# EasyEDA Pro project HNDX.eprj, schematic Schematic1_3
Board Name: mspm0g3507; Create Date: 2024-08-21; Page Name: P1; Project Name: GP; Schematic Name: Schematic1_3; Update Date: 2025-07-14; Company: 嘉立创EDA; Page Size: A4; Version: V1.0
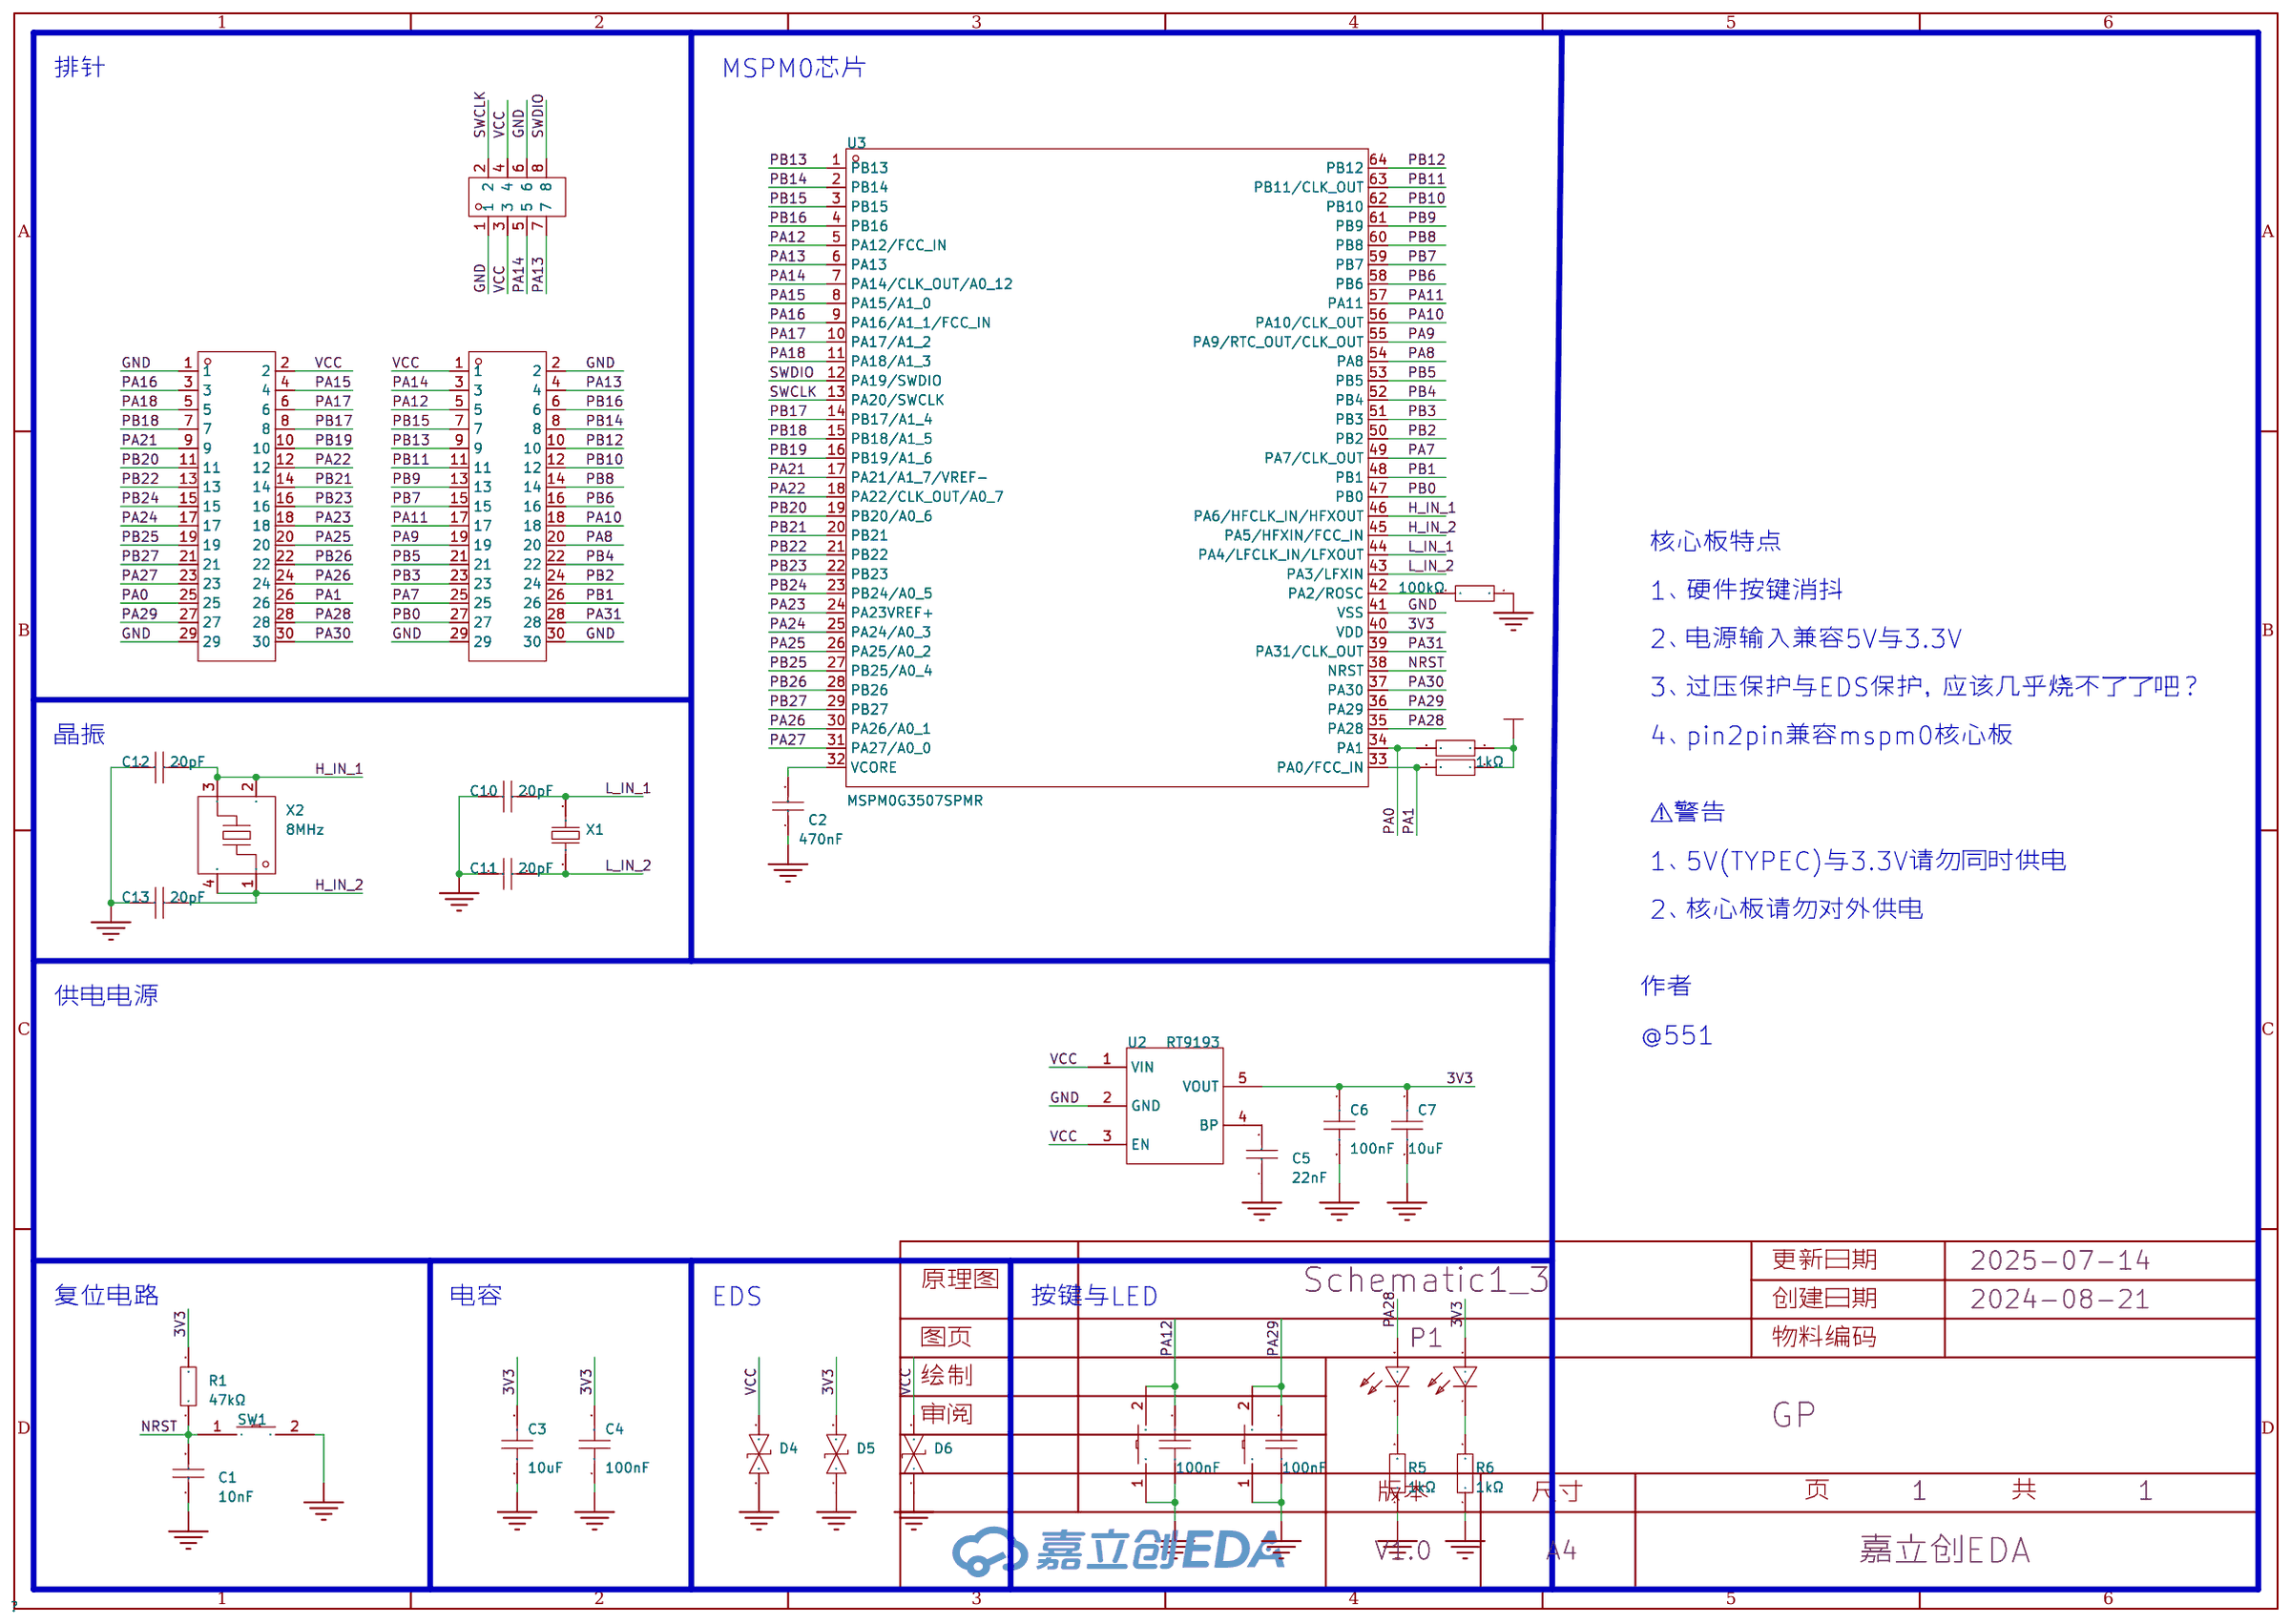
[diagram p0: schematic sheet]

## Parts
C1  10nF  [C0603]
C2  470nF  [C0603]
C3  10uF  [C0603]
C4  100nF  [C0603]
C5  22nF  [C0603]
C6  100nF  [C0603]
C7  10uF  [C0603]
C8  100nF  [C0603]
C9  100nF  [C0603]
C10  20pF  [C0603]
C11  20pF  [C0603]
C12  20pF  [C0603]
C13  20pF  [C0603]
D4  0603ESDA-05N  [D0603-BI]
D5  0603ESDA-05N  [D0603-BI]
D6  0603ESDA-05N  [D0603-BI]
H3  PZ254R-12-8P  [HDR-TH_8P-P2.54-H-M-R2-C4-S2.54]
LED1  NCD0603R1  [LED0603-RD_RED]
LED2  NCD0603R1  [LED0603-RD_RED]
R1  47kΩ  [R0603]
R2  1kΩ  [R0603]
R3  1kΩ  [R0603]
R4  100kΩ  [R0603]
R5  1kΩ  [R0603]
R6  1kΩ  [R0603]
SW1  TS-1101-C-W  [SW-SMD_L6.0-W3.3-LS8.0]
SW2  TS-1101-C-W  [SW-SMD_L6.0-W3.3-LS8.0]
SW3  TS-1101-C-W  [SW-SMD_L6.0-W3.3-LS8.0]
U2  RT9193  [SOT-23-5_L3.0-W1.7-P0.95-LS2.8-BL]
U3  MSPM0G3507SPMR  [LQFP-64_L10.0-W10.0-P0.50-LS12.0-BL]
U12  PZ254-2-15-Z-8.5  [HDR-TH_30P-P2.54-V-M-R2-C15-S2.54]
U13  PZ254-2-15-Z-8.5  [HDR-TH_30P-P2.54-V-M-R2-C15-S2.54]
X1  32.768kHz  [FC-135R_L3.2-W1.5]
X2  8MHz  [CRYSTAL-SMD_4P-L3.2-W2.5-BL-1]

## Library data of the parts
C1 = CC0603KRX7R9BB103: 容值:10nF;精度:±10%;额定电压:50V;材质(温度系数):X7R;; LCSC Part Name: 10nF ±10% 50V; Supplier Part: C100042; Manufacturer: YAGEO(国巨); Supplier Footprint: 0603; JLCPCB Part Class: 扩展库; Datasheet: https://atta.szlcsc.com/upload/public/pdf/source/20181008/C309510_22F155564471FAF6A489F7D68F34234E.pdf; Supplier: LCSC; Tolerance: ±10%; Voltage Rated: 50V; Temperature Coefficient: X7R
C2 = CL10B474KA8NNNC: 容值:470nF;精度:±10%;额定电压:25V;材质(温度系数):X7R;; LCSC Part Name: 470nF ±10% 25V; Supplier Part: C1623; Manufacturer: SAMSUNG(三星); Supplier Footprint: 0603; JLCPCB Part Class: 基础库; Datasheet: https://atta.szlcsc.com/upload/public/pdf/source/20160218/1457707763339.pdf; Supplier: LCSC; Tolerance: ±10%; Voltage Rated: 25V; Temperature Coefficient: X7R
C3 = CL10A106KP8NNNC: 容值:10uF;精度:±10%;额定电压:10V;材质(温度系数):X5R;; LCSC Part Name: 10uF ±10% 10V; Supplier Part: C19702; Manufacturer: SAMSUNG(三星); Supplier Footprint: 0603; JLCPCB Part Class: 基础库; Datasheet: https://atta.szlcsc.com/upload/public/pdf/source/20160218/1457707763339.pdf; Supplier: LCSC; Tolerance: ±10%; Voltage Rated: 10V; Temperature Coefficient: X5R
C4 C6 C8 C9 = CC0603KRX7R9BB104: 容值:100nF;精度:±10%;额定电压:50V;材质(温度系数):X7R;; LCSC Part Name: 100nF ±10% 50V; Supplier Part: C14663; Manufacturer: YAGEO(国巨); Supplier Footprint: 0603; JLCPCB Part Class: 基础库; Datasheet: https://atta.szlcsc.com/upload/public/pdf/source/20180910/C282072_33301C7F631E79921B82A8DAC6BCC5B3.pdf; Supplier: LCSC; Tolerance: ±10%; Voltage Rated: 50V; Temperature Coefficient: X7R
C5 = CL10B223KB8NNNC: 容值:22nF;精度:±10%;额定电压:50V;材质(温度系数):X7R;; LCSC Part Name: 22nF ±10% 50V; Supplier Part: C21122; Manufacturer: SAMSUNG(三星); Supplier Footprint: 0603; JLCPCB Part Class: 基础库; Datasheet: https://atta.szlcsc.com/upload/public/pdf/source/20160218/1457707763339.pdf; Supplier: LCSC; Tolerance: ±10%; Voltage Rated: 50V; Temperature Coefficient: X7R
C7 = GRM188R61E106KA73D: 容值:10uF;精度:±10%;额定电压:25V;材质(温度系数):X5R;; LCSC Part Name: 10uF ±10% 25V; Supplier Part: C344022; Manufacturer: muRata(村田); Supplier Footprint: 0603; JLCPCB Part Class: 扩展库; Datasheet: https://atta.szlcsc.com/upload/public/pdf/source/20181211/C344022_BB98D43E7DA95E5A749FBFE073C8A3E0.pdf; Supplier: LCSC; Tolerance: ±10%; Voltage Rated: 25V; Temperature Coefficient: X5R
C10-C13 = CC0603JRNPO9BN200: 容值:20pF;精度:±5%;额定电压:50V;材质(温度系数):NP0;; LCSC Part Name: 20pF ±5% 50V; Supplier Part: C105621; Manufacturer: YAGEO(国巨); Supplier Footprint: 0603; JLCPCB Part Class: 扩展库; Datasheet: https://atta.szlcsc.com/upload/public/pdf/source/20170505/1493957838062.pdf; Supplier: LCSC; Tolerance: ±5%; Voltage Rated: 50V; Temperature Coefficient: NP0
D4-D6 = 0603ESDA-05N: LCSC Part Name: 双向ESD; Supplier Part: C316054; Manufacturer: BORN(伯恩半导体); Supplier Footprint: 0603; JLCPCB Part Class: 扩展库; Datasheet: https://atta.szlcsc.com/upload/public/pdf/source/20200528/C316054_1CC523E9CE69E41C8DD5A05C832CCD1A.pdf; Supplier: LCSC; polarity: 双向; Reverse Stand-Off Voltage (Vrwm): 5V; Maximum Clamping Voltage: 50V; Type: ESD
H3 = PZ254R-12-8P: 插针结构:2x4P;间距:2.54mm;行距:2.54mm;圆针/方针:方针;安装类型:弯插;排数:双排;总PIN位数:8P;额定电流:-;额定电压:-;配合针长度:6mm;塑高:2.5mm;触头材质:黄铜;触头镀层:-;工作温度范围:-40℃~+105℃;颜色:黑色;; LCSC Part Name: 间距:2.54mm 2x4P 弯插 方针; Supplier Part: C492432; Manufacturer: XFCN(兴飞); Supplier Footprint: 弯插,P=2.54mm; JLCPCB Part Class: 扩展库; Datasheet: https://atta.szlcsc.com/upload/public/pdf/source/20200309/C492432_F55471C7391A7FE3415CB31C718B6320.pdf; Supplier: LCSC; Pin Structure: 2x4P; Pitch: 2.54mm; Row Spacing: 2.54mm; Circluar Pins/Square Pins: 方针; Mounting Type: 弯插; Number of Rows: 双排; Number of Pins: 8P; Length of Mating Pin: 6mm; Insulation Height: 2.5mm; Contact Material: 黄铜; Operating Temperature Range: -40℃~+105℃; Color: 黑色
LED1 LED2 = NCD0603R1_C84263: 灯头类型:-;发光颜色:红色;正向电压(VF):1.6V~2.6V;功率:65mW;正向电流:20mA;主波长:615nm~630nm;二极管配置:独立二极管;透镜颜色:无色透明透镜;色温:-;发光强度:80mcd~220mcd;发光角度:130°;载带方式:-;工作温度:-30℃~+85℃;; Supplier Part: C84263; Manufacturer: 国星光电; Supplier Footprint: 0603; JLCPCB Part Class: 扩展库; Datasheet: https://atta.szlcsc.com/upload/public/pdf/source/20200820/C84263_DABC6A75E58F576973B407FDBA283D60.pdf; Supplier: LCSC; Emitted Color: 红色; Forward Voltage (VF): 1.6V~2.6V; Power Dissipation: 65mW; Forward Current: 20mA; Dominant Wavelength: 615nm~630nm; Diode Configuration: 独立二极管; Lens Color: 无色透明透镜; Luminous Intensity: 80mcd~220mcd; Viewing Angle: 130°; Operating Temperature: -30℃~+85℃
R1 = 0603WAF4702T5E: 电阻类型:厚膜电阻;阻值:47kΩ;精度:±1%;功率:100mW;最大工作电压:75V;温度系数:±100ppm/℃;; LCSC Part Name: 47kΩ ±1% 100mW 厚膜电阻; Supplier Part: C25819; Manufacturer: UNI-ROYAL(厚声); Supplier Footprint: 0603; JLCPCB Part Class: 基础库; Datasheet: https://atta.szlcsc.com/upload/public/pdf/source/20200306/C422600_1E6D84923E4A46A82E41ADD87F860B5C.pdf; Supplier: LCSC; Type: 厚膜电阻; Tolerance: ±1%; Power(Watts): 100mW; Overload Voltage (Max): 75V; Temperature Coefficient: ±100ppm/℃; Operating Temperature Range: -55℃~+155℃
R2 R3 R5 R6 = 0603WAF1001T5E: 电阻类型:厚膜电阻;阻值:1kΩ;精度:±1%;功率:100mW;最大工作电压:75V;温度系数:±100ppm/℃;; LCSC Part Name: 1kΩ ±1% 100mW 厚膜电阻; Supplier Part: C21190; Manufacturer: UNI-ROYAL(厚声); Supplier Footprint: 0603; JLCPCB Part Class: 基础库; Datasheet: https://atta.szlcsc.com/upload/public/pdf/source/20200306/C422600_1E6D84923E4A46A82E41ADD87F860B5C.pdf; Supplier: LCSC; Type: 厚膜电阻; Tolerance: ±1%; Power(Watts): 100mW; Overload Voltage (Max): 75V; Temperature Coefficient: ±100ppm/℃; Operating Temperature Range: -55℃~+155℃
R4 = 0603WAF1003T5E: 电阻类型:厚膜电阻;阻值:100kΩ;精度:±1%;功率:100mW;最大工作电压:75V;温度系数:±100ppm/℃;; LCSC Part Name: 100kΩ ±1% 100mW 厚膜电阻; Supplier Part: C25803; Manufacturer: UNI-ROYAL(厚声); Supplier Footprint: 0603; JLCPCB Part Class: 基础库; Datasheet: https://atta.szlcsc.com/upload/public/pdf/source/20200306/C422600_1E6D84923E4A46A82E41ADD87F860B5C.pdf; Supplier: LCSC; Type: 厚膜电阻; Tolerance: ±1%; Power(Watts): 100mW; Overload Voltage (Max): 75V; Temperature Coefficient: ±100ppm/℃; Operating Temperature Range: -55℃~+155℃
SW1-SW3 = TS-1101-C-W: 电路结构:单刀单掷;按钮形状:矩形按钮;作用力:260gf;安装方式:立贴;开关长度:6mm;开关宽度:3.6mm;开关高度:2.5mm;带支架:不带;触点电流:50mA;额定电压(AC):-;额定电压(DC):12V;额定功率:-;绝缘电阻:-;带灯:无;机械寿命:5万次;; LCSC Part Name: 6*3.6*2.5mm 立贴 轻触开关; Supplier Part: C318938; Manufacturer: XKB Connectivity(中国星坤); Supplier Footprint: SMD; JLCPCB Part Class: 扩展库; Datasheet: https://atta.szlcsc.com/upload/public/pdf/source/20200227/C318938_C2E53B1EEDE37D980A33616AC086DE53.pdf; Supplier: LCSC; Circuit: 单刀单掷; Actuator Style: 矩形按钮; Operating Force: 260gf; Mounting Style: 立贴; Switch Length: 6mm; Switch Width: 3.6mm; Switch Height: 2.5mm; Strike Gundam: 不带; Contact Current: 50mA; Voltage Rating (DC): 12V; Actuator/Cap Color: 白色带淡绿; With Lamp: 无; Mechanical Life: 5万次; Operating Temperature: -30℃~+85℃
U2 = RT9193-33GB: 输出类型:固定;最大输入电压:5.5V;输出电压:3.3V;最大输出电流:300mA;电源纹波抑制比(PSRR):70dB;输出极性:正极;; LCSC Part Name: 输入5.5V 输出3.3V 300mA; Supplier Part: C15651; Manufacturer: RICHTEK(立锜); Supplier Footprint: SOT-23-5; JLCPCB Part Class: 扩展库; Datasheet: https://atta.szlcsc.com/upload/public/pdf/source/20130730/1457706628575.pdf; Supplier: LCSC; Output Type: 固定; Maximum Input Voltage: 5.5V; Output Voltage: 3.3V; MAX Output Current: 300mA; Power Supply Rejection Ratio (PSRR): 70dB; Dropout Voltage: 300mV@(300mA); standby current: 130uA; Operating Temperature: -40℃~+125℃; Output Polarity: 正极; Number of Outputs: 1
U3 = MSPM0G3507SPMR: Supplier Part: C9900086340; Supplier Footprint: SMD; JLCPCB Part Class: Extended Part; Supplier: LCSC
U12 U13 = PZ254-2-15-Z-8.5: 插针结构:2x15P;间距:2.54mm;圆针/方针:方针;安装类型:直插;排数:双排;总PIN位数:30P;额定电流:3A;额定电压:-;配合针长度:6mm;塑高:2.5mm;端接针长度:3mm;触头材质:黄铜;工作温度范围:-40℃~+105℃;焊接温度(最大值):260℃@10S;颜色:黑色;; LCSC Part Name: 2x15P 间距:2.54mm 方针 直插; Supplier Part: C3012255; Manufacturer: HCTL(华灿天禄); Supplier Footprint: 插件,P=2.54mm; JLCPCB Part Class: 扩展库; Datasheet: https://atta.szlcsc.com/upload/public/pdf/source/20230609/5BA09C8BEB9B31376F8BF6032FF67CAC.pdf; Supplier: LCSC; Pin Structure: 2x15P; Pitch: 2.54mm; Circluar Pins/Square Pins: 方针; Mounting Type: 直插; Number of Rows: 双排; Number of Pins: 30P; Current Rating (Max): 3A; Length of Mating Pin: 6mm; Insulation Height: 2.5mm; Length of End Connection Pin: 3mm; Contact Material: 黄铜; Operating Temperature Range: -40℃~+105℃; Soldering Temperature(Max): 260℃@10S; Color: 黑色
X1 = Q13FC13500004_C32346: 晶振类型:贴片晶振;频率:32.768kHz;常温频差:±20ppm;外接负载电容:12.5pF;; LCSC Part Name: 32.768kHz ±20ppm 12.5pF; Supplier Part: C32346; Manufacturer: EPSON(爱普生); Manufacturer Part: Q13FC13500004; Supplier Footprint: SMD3215-2P; JLCPCB Part Class: 基础库; Datasheet: https://atta.szlcsc.com/upload/public/pdf/source/20240418/0E0FF5F0356BA3753F616001439D1416.pdf; Supplier: LCSC; Crystal Type: 贴片晶振; Normal temperature Frequency Tolerance: ±20ppm; External load capacitor: 12.5pF; Equivalent Series Resistance (ESR): 70kΩ; Operating Temperature: -40℃~+85℃
X2 = XL2EL89COI-111YLC-8M: 晶振类型:贴片晶振;频率:8MHz;常温频差:±10ppm;外接负载电容:12pF;频率稳定度(全温):±20ppm;; LCSC Part Name: 8MHz ±10ppm 12pF; Supplier Part: C2973805; Manufacturer: YXC(扬兴晶振); Supplier Footprint: SMD3225-4P; JLCPCB Part Class: 扩展库; Datasheet: https://atta.szlcsc.com/upload/public/pdf/source/20240329/19D5F850207469550BEB00D7DFEDBC7A.pdf; Supplier: LCSC; Crystal Type: 贴片晶振; Normal temperature Frequency Tolerance: ±10ppm; External load capacitor: 12pF; Frequency Stability(Full temperature range): ±20ppm; Equivalent Series Resistance (ESR): 150Ω; Operating Temperature: -40℃~+85℃

## Nets
3V3: C3.2 C4.2 C6.1 C7.1 D5.2 LED2.2(A) R1.2 R2.2 R3.1 U2.5(VOUT) U3.40(VDD)
GND: C1.1 C2.1 C3.1 C4.1 C5.1 C6.2 C7.2 C8.2 C9.1 C10.1 C11.1 C12.1 C13.1 D4.1 D5.1 D6.1 H3.1 H3.6 R4.1 R5.1 R6.1 SW1.2 SW2.1 SW3.1 U2.2(GND) U3.41(VSS) U12.2 U12.29 U12.30 U13.1 U13.29
VCC: D4.2 D6.2 H3.3 H3.4 U2.1(VIN) U2.3(EN) U12.1 U13.2
H_IN_1: C12.2 U3.46(PA6/HFCLK_IN/HFXOUT) X2.2(GND) X2.3
H_IN_2: C13.2 U3.45(PA5/HFXIN/FCC_IN) X2.1 X2.4(GND)
L_IN_1: C10.2 U3.44(PA4/LFCLK_IN/LFXOUT) X1.2
L_IN_2: C11.2 U3.43(PA3/LFXIN) X1.1
NRST: C1.2 R1.1 SW1.1 U3.38(NRST)
PA0: R2.1 U3.34(PA1) U13.25
PA1: R3.2 U3.33(PA0/FCC_IN) U13.26
PA7: U3.49(PA7/CLK_OUT) U12.25
PA8: U3.54(PA8) U12.20
PA9: U3.55(PA9/RTC_OUT/CLK_OUT) U12.19
PA10: U3.56(PA10/CLK_OUT) U12.18
PA11: U3.57(PA11) U12.17
PA12: C8.1 SW2.2 U3.5(PA12/FCC_IN) U12.5
PA13: H3.7 U3.6(PA13) U12.4
PA14: H3.5 U3.7(PA14/CLK_OUT/A0_12) U12.3
PA15: U3.8(PA15/A1_0) U13.4
PA16: U3.9(PA16/A1_1/FCC_IN) U13.3
PA17: U3.10(PA17/A1_2) U13.6
PA18: U3.11(PA18/A1_3) U13.5
PA21: U3.17(PA21/A1_7/VREF-) U13.9
PA22: U3.18(PA22/CLK_OUT/A0_7) U13.12
PA23: U3.24(PA23VREF+) U13.18
PA24: U3.25(PA24/A0_3) U13.17
PA25: U3.26(PA25/A0_2) U13.20
PA26: U3.30(PA26/A0_1) U13.24
PA27: U3.31(PA27/A0_0) U13.23
PA28: LED1.2(A) U3.35(PA28) U13.28
PA29: C9.2 SW3.2 U3.36(PA29) U13.27
PA30: U3.37(PA30) U13.30
PA31: U3.39(PA31/CLK_OUT) U12.28
PB0: U3.47(PB0) U12.27
PB1: U3.48(PB1) U12.26
PB2: U3.50(PB2) U12.24
PB3: U3.51(PB3) U12.23
PB4: U3.52(PB4) U12.22
PB5: U3.53(PB5) U12.21
PB6: U3.58(PB6) U12.16
PB7: U3.59(PB7) U12.15
PB8: U3.60(PB8) U12.14
PB9: U3.61(PB9) U12.13
PB10: U3.62(PB10) U12.12
PB11: U3.63(PB11/CLK_OUT) U12.11
PB12: U3.64(PB12) U12.10
PB13: U3.1(PB13) U12.9
PB14: U3.2(PB14) U12.8
PB15: U3.3(PB15) U12.7
PB16: U3.4(PB16) U12.6
PB17: U3.14(PB17/A1_4) U13.8
PB18: U3.15(PB18/A1_5) U13.7
PB19: U3.16(PB19/A1_6) U13.10
PB20: U3.19(PB20/A0_6) U13.11
PB21: U3.20(PB21) U13.14
PB22: U3.21(PB22) U13.13
PB23: U3.22(PB23) U13.16
PB24: U3.23(PB24/A0_5) U13.15
PB25: U3.27(PB25/A0_4) U13.19
PB26: U3.28(PB26) U13.22
PB27: U3.29(PB27) U13.21
SWCLK: H3.2 U3.13(PA20/SWCLK)
SWDIO: H3.8 U3.12(PA19/SWDIO)
$1N1418: C5.2 U2.4(BP)
$1N2545: LED2.1(K) R6.2
$1N7826: R4.2 U3.42(PA2/ROSC)
$1N8188: C2.2 U3.32(VCORE)
$1N18671: LED1.1(K) R5.2

## Notes on the sheet
- 排针
- MSPM0芯片
- 核心板特点
- 1、硬件按键消抖
- 2、电源输入兼容5V与3.3V
- 3、过压保护与EDS保护，应该几乎烧不了了吧？
- 晶振
- 4、pin2pin兼容mspm0核心板
- ⚠警告
- 1、5V(TYPEC)与3.3V请勿同时供电
- 2、核心板请勿对外供电
- 作者
- 供电电源
- @551
- 复位电路
- 电容
- EDS
- 按键与LED
